# EAGLE design raspnixie (EAGLE 9.6.2)
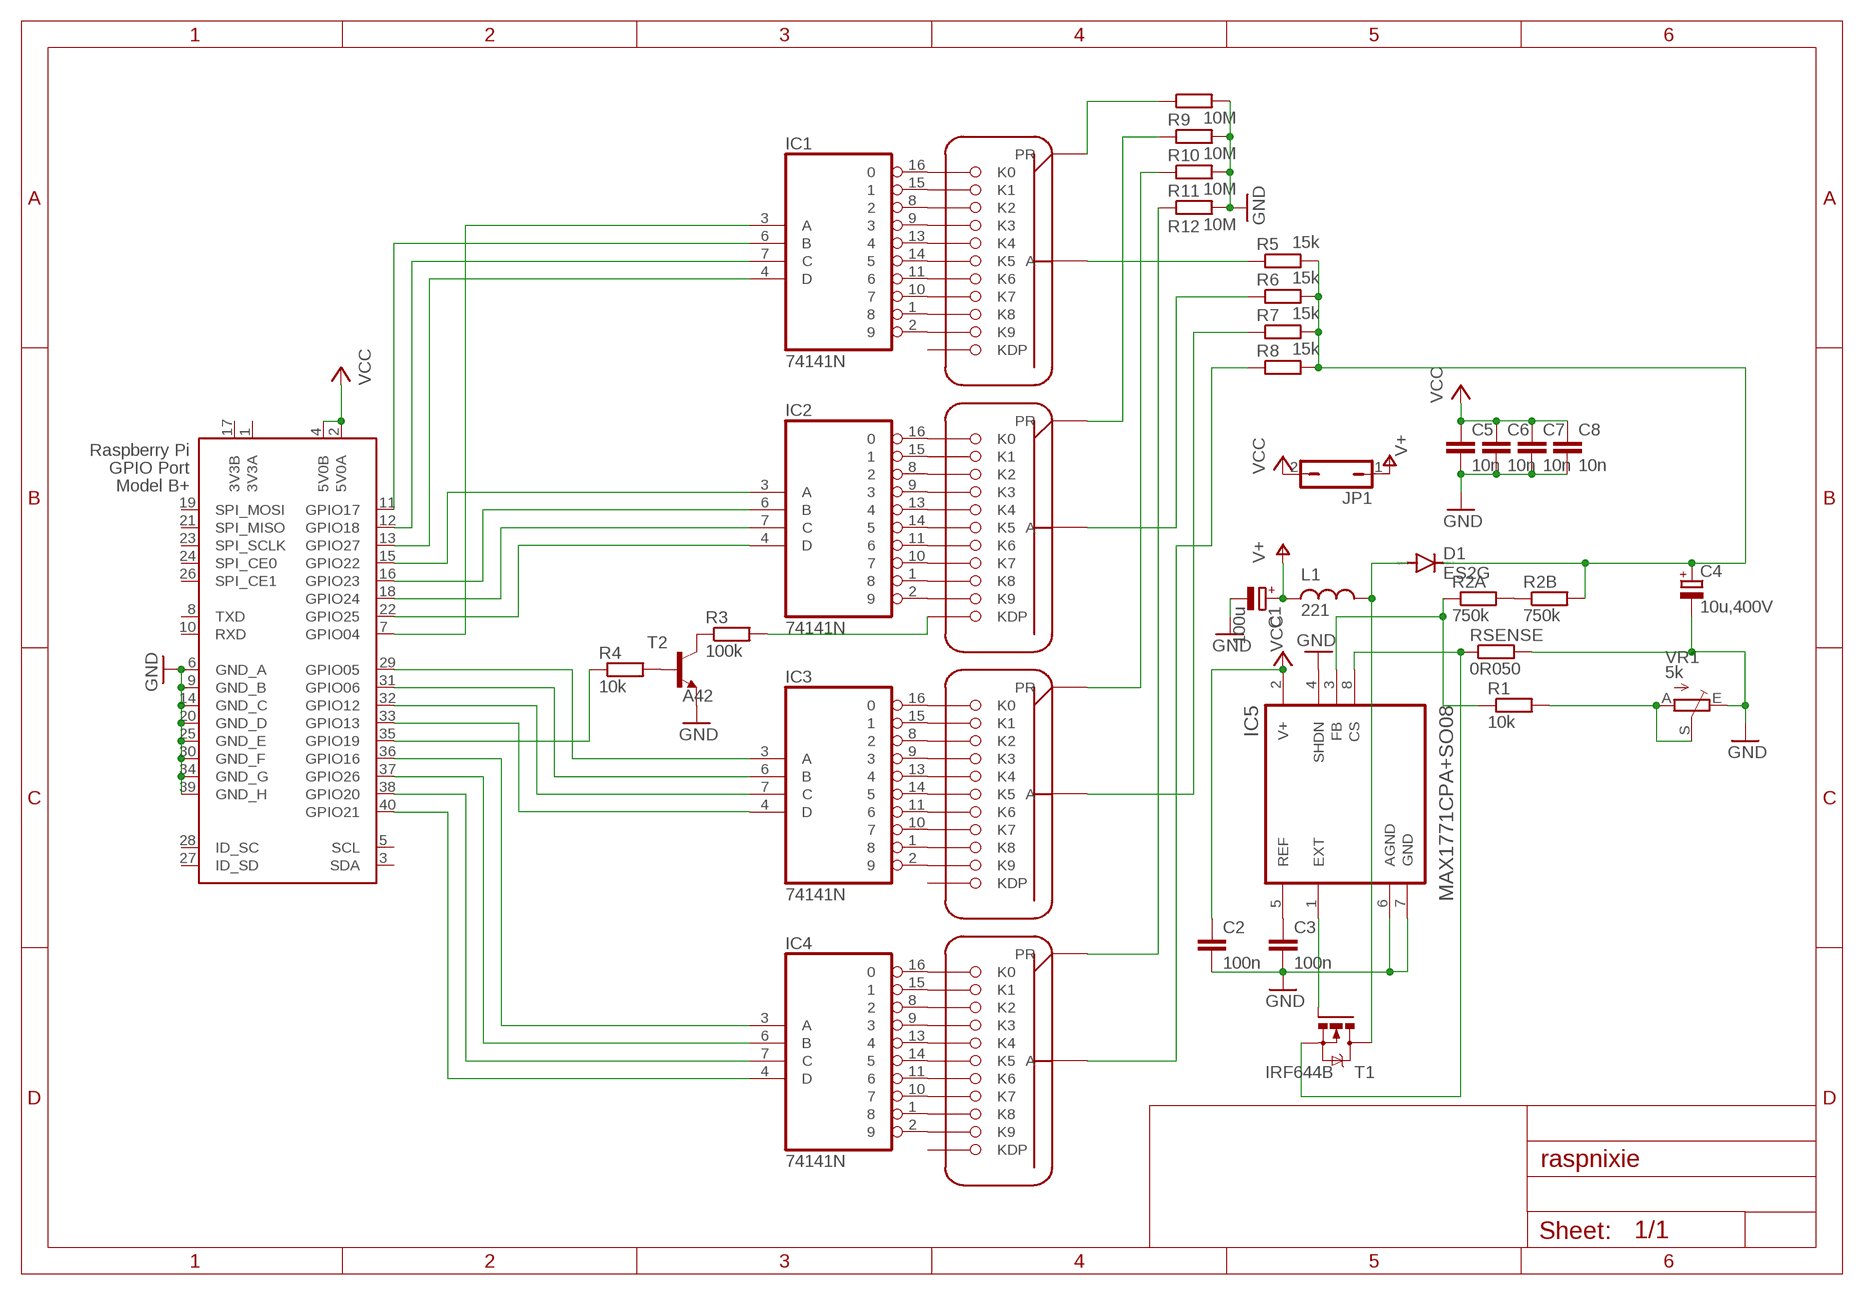
[diagram p0: schematic, sheet 1]

## Parts
C1  100u  CPOL-EUCT7343  [CT7343]
C2  100n  C-EUC1206K  [C1206K]
C3  100n  C-EUC1206K  [C1206K]
C4  10u,400V  CPOL-EUE5-10.5  [E5-10,5]
C5  10n  C-EUC1206K  [C1206K]
C6  10n  C-EUC1206K  [C1206K]
C7  10n  C-EUC1206K  [C1206K]
C8  10n  C-EUC1206K  [C1206K]
D1  ES2G  DIODE-DO214AA  [DO214AA]
IC1  74141N  [DIL16]
IC2  74141N  [DIL16]
IC3  74141N  [DIL16]
IC4  74141N  [DIL16]
IC5  MAX1771CPA+SO08  [SO08]
JP1  JP1Q  [JP1]
L1  221  WHC1770  [RESM175170X700N]
R1  10k  R-EU_R1206  [R1206]
R2A  750k  R-EU_R1206  [R1206]
R2B  750k  R-EU_R1206  [R1206]
R3  100k  R-EU_R1206  [R1206]
R4  10k  R-EU_R1206  [R1206]
R5  15k  R-EU_R1206  [R1206]
R6  15k  R-EU_R1206  [R1206]
R7  15k  R-EU_R1206  [R1206]
R8  15k  R-EU_R1206  [R1206]
R9  10M  R-EU_R1206  [R1206]
R10  10M  R-EU_R1206  [R1206]
R11  10M  R-EU_R1206  [R1206]
R12  10M  R-EU_R1206  [R1206]
RSENSE  0R050  R-EU_R2010  [R2010]
T1  IRF644B  IRF540  [TO220BV]
T2  A42  -NPN-TO92  [TO92]
U1  ZM1000  [ZM1000]
U2  ZM1000  [ZM1000]
U3  ZM1000  [ZM1000]
U4  ZM1000  [ZM1000]
VR1  5k  TRIM_EU-S64W-ROUND  [S64W-ROUND]
X1  RASPI_BOARD_B+#_E3  [RASPI_BOARD_B+_EDGES_3DRILL]

## Nets
GND: C1.- C2.2 C3.2 C4.- C5.2 C6.2 C7.2 C8.2 IC5.4(SHDN) IC5.6(AGND) IC5.7(GND) R9.2 R10.2 R11.2 R12.2 RSENSE.2 T2.1(E) VR1.E X1.6(GND_A) X1.9(GND_B) X1.14(GND_C) X1.20(GND_D) X1.25(GND_E) X1.30(GND_F) X1.34(GND_G) X1.39(GND_H)
N$1: R9.1 U1.PR
N$2: R10.1 U2.PR
N$3: R11.1 U3.PR
N$4: R12.1 U4.PR
N$5: IC1.2 U1.K9
N$6: IC1.16 U1.K0
N$7: IC1.15 U1.K8(K1)
N$8: IC1.8 U1.K2
N$9: IC1.9 U1.K3
N$10: IC1.13 U1.K4
N$11: IC1.14 U1.K5
N$12: IC1.11 U1.K6
N$13: IC1.10 U1.K7
N$14: IC1.1 U1.K1(K8)
N$15: IC2.2 U2.K9
N$16: IC2.16 U2.K0
N$17: IC2.15 U2.K8(K1)
N$18: IC2.8 U2.K2
N$19: IC2.9 U2.K3
N$20: IC2.13 U2.K4
N$21: IC2.14 U2.K5
N$22: IC2.11 U2.K6
N$23: IC2.10 U2.K7
N$24: IC2.1 U2.K1(K8)
N$25: IC3.2 U3.K9
N$26: IC3.16 U3.K0
N$27: IC3.15 U3.K8(K1)
N$28: IC3.8 U3.K2
N$29: IC3.9 U3.K3
N$30: IC3.13 U3.K4
N$31: IC3.14 U3.K5
N$32: IC3.11 U3.K6
N$33: IC3.10 U3.K7
N$34: IC3.1 U3.K1(K8)
N$35: IC4.2 U4.K9
N$36: IC4.16 U4.K0
N$37: IC4.15 U4.K8(K1)
N$38: IC4.8 U4.K2
N$39: IC4.9 U4.K3
N$40: IC4.13 U4.K4
N$41: IC4.14 U4.K5
N$42: IC4.11 U4.K6
N$43: IC4.10 U4.K7
N$44: IC4.1 U4.K1(K8)
N$45: IC1.3(A) X1.7(GPIO04)
N$46: IC1.6(B) X1.11(GPIO17)
N$47: IC1.7(C) X1.12(GPIO18)
N$48: IC1.4(D) X1.13(GPIO27)
N$49: C3.1 IC5.5(REF)
N$50: IC2.6(B) X1.16(GPIO23)
N$51: IC2.7(C) X1.18(GPIO24)
N$52: IC2.4(D) X1.22(GPIO25)
N$53: IC3.3(A) X1.29(GPIO05)
N$54: IC3.6(B) X1.31(GPIO06)
N$55: IC3.7(C) X1.32(GPIO12)
N$56: IC3.4(D) X1.33(GPIO13)
N$57: IC4.3(A) X1.36(GPIO16)
N$58: IC4.6(B) X1.37(GPIO26)
N$59: IC4.7(C) X1.38(GPIO20)
N$60: IC4.4(D) X1.40(GPIO21)
N$61 [power]: IC5.1(EXT) T1.G
N$62 [power]: D1.A L1.2 T1.D
N$63 [power]: IC5.8(CS) RSENSE.1 T1.S
N$64: IC2.3(A) X1.15(GPIO22)
N$65: R5.1 U1.A1(A) U1.A2(A)
N$66: R6.1 U2.A1(A) U2.A2(A)
N$67: R4.2 T2.2(B)
N$68: R3.1 T2.3(C)
N$69: R1.2 VR1.A VR1.S
N$70: IC5.3(FB) R1.1 R2A.1
N$71: R7.1 U3.A1(A) U3.A2(A)
N$72: R8.1 U4.A1(A) U4.A2(A)
N$73: R4.1 X1.35(GPIO19)
N$74: R3.2 U2.KDP
N$75: R2A.2 R2B.1
V+ [power]: C1.+ JP1.1 L1.1
VCC: C2.1 C5.1 C6.1 C7.1 C8.1 IC5.2(V+) JP1.2 X1.2(5V0A) X1.4(5V0B)
VH: C4.+ D1.C R2B.2 R5.2 R6.2 R7.2 R8.2
Unconnected: U1.KDP U3.KDP U4.KDP X1.3(SDA) X1.5(SCL) X1.8(TXD) X1.10(RXD) X1.19(SPI_MOSI) X1.21(SPI_MISO) X1.23(SPI_SCLK) X1.24(SPI_CE0) X1.26(SPI_CE1) X1.27(ID_SD) X1.28(ID_SC)

## Power pins joined to a net without a drawn wire
3V3A: X1.1(3V3A)
3V3B: X1.17(3V3B)
GND: IC1.12(GND) IC2.12(GND) IC3.12(GND) IC4.12(GND)
VCC: IC1.5(VCC) IC2.5(VCC) IC3.5(VCC) IC4.5(VCC)

## Library data of the parts
C1 C4 = rcl:CPOL-EU: POLARIZED CAPACITOR, European symbol; SPICEPREFIX: C
C2 C3 C5-C8 = rcl:C-EU: CAPACITOR, European symbol; SPICEPREFIX: C
D1 = diode:DIODE-: DIODE
IC1-IC4 = raspnixie:74*141: BCD to decimal DECODER/DRIVER
IC5 = raspnixie:MAX1771CPA+: None
JP1 = jumper:JP1Q: JUMPER
L1 = raspnixie:WHC1770
R1 R2A R2B R3-R12 RSENSE = rcl:R-EU_: RESISTOR, European symbol; SPICEPREFIX: R
T1 = transistor-power:IRF540: HEXFET Power MOSFET
T2 = transistor:*-NPN-: NPN Transistror BF959 corrected 2008.03.06
U1-U4 = raspnixie:ZM1000
VR1 = raspnixie:TRIM_EU-: POTENTIOMETER
X1 = raspnixie:RASPI_BOARD_B+#: Raspberry Pi GPIO connector with markings for the outer dimensions of the Raspberry Pi board model B+ with different sets of drill holes or mounting pads All pins connected; SPICEPREFIX: X

## Net classes
0 default: width 0.152 mm, drill 0.3 mm, clearance 0.152 mm
1 power: width 1.397 mm, drill 0.635 mm, clearance 0.508 mm to class 0, clearance 0.508 mm

## Board
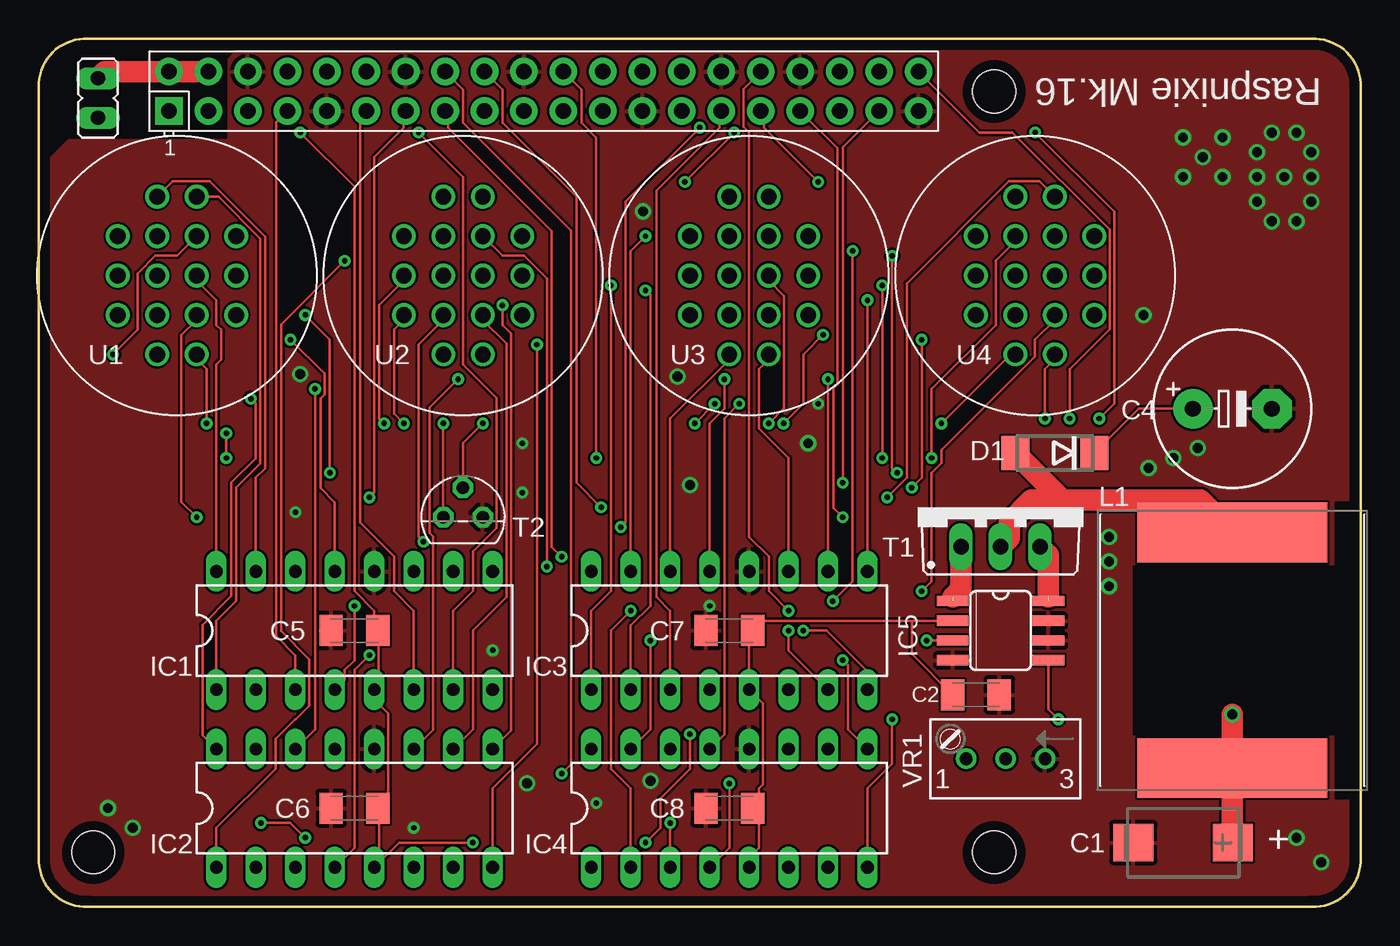
[diagram p1: board, top side]
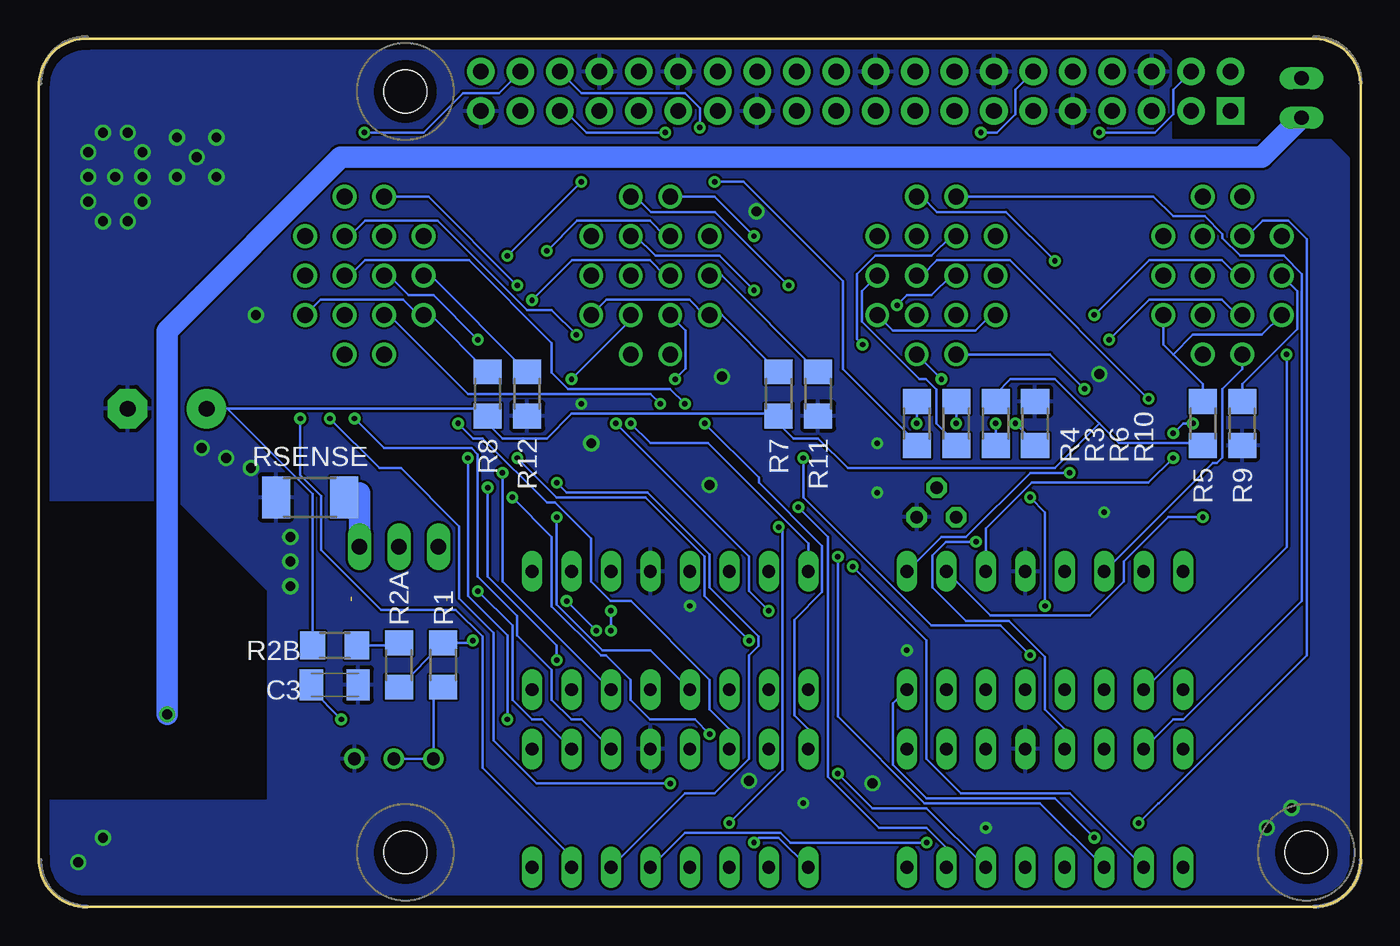
[diagram p2: board, bottom side, seen from below]

Size 85.09 x 55.88 mm. Coordinates in mm from the lower left corner, seen from the top.
Outline: 3.18,55.88 81.92,55.88 arc-90 85.09,53.02 85.09,3.18 arc-96 81.92,0 3.18,0 arc-96 0,3.18 0,53.02 arc-90 3.18,55.88
Copper layers (1*16): Top 0.035mm / dielectric 1.5mm / Bottom 0.035mm
Design rules "default *": minimum track width 6mil, minimum drill 0.35mm, track to track 6mil, track to pad 6mil, pad to pad 6mil, via to via 6mil, smd to smd 6mil, copper to edge 25mil, drill to drill 6mil, minimum pad ring 10mil, minimum via ring 8mil, stop-mask expansion 4mil, vias tented up to drill 0mil, thermal gap 10mil
tRestrict: area 70.5,7 to 84.5,26; area -0.6,48.3 to 12.7,55.2
bRestrict: area 70.5,7 to 84.5,26; area -1.3,48.3 to 12.7,55.2

### Footprints (pad centres in the part's own frame; a part is rotated, then mirrored left to right if it is on the bottom)
CT7343 = smd 2.6 x 2.4: + -3.2,0; - 3.2,0
C1206K = smd 1.5 x 2: 1 -1.5,0; 2 1.5,0
E5-10,5 = drill 1.016 pad 2.54: + -2.54,0 | drill 1.016 pad 2.54 octagon: - 2.54,0
DO214AA = smd 1.8 x 2.2: A 2.55,0; C -2.55,0
DIL16 = drill 0.813 long: 1 -8.89,-3.81; 2 -6.35,-3.81; 3 -3.81,-3.81; 4 -1.27,-3.81; 5 1.27,-3.81; 6 3.81,-3.81; 7 6.35,-3.81; 8 8.89,-3.81; 9 8.89,3.81; 10 6.35,3.81; 11 3.81,3.81; 12 1.27,3.81; 13 -1.27,3.81; 14 -3.81,3.81; 15 -6.35,3.81; 16 -8.89,3.81
SO08 = smd 0.66 x 2.032: 1 -1.905,-3.073; 2 -0.635,-3.073; 3 0.635,-3.073; 4 1.905,-3.073; 5 1.905,3.073; 6 0.635,3.073; 7 -0.635,3.073; 8 -1.905,3.073
JP1 = drill 0.914 long: 1 0,-1.27; 2 0,1.27
RESM175170X700N = smd 3.838 x 12.21: 1 -7.584,0; 2 7.584,0
R1206 = smd 1.6 x 1.803: 1 -1.422,0; 2 1.422,0
R2010 = smd 1.8 x 2.7: 1 -2.2,0; 2 2.2,0
TO220BV = drill 1.016 long: D 0,-2.54; G -2.54,-2.54; S 2.54,-2.54
TO92 = drill 0.813 octagon: 1 1.27,0; 2 0,1.905; 3 -1.27,0
ZM1000 = drill 1.016: A1 -3.81,-2.54; A2 3.81,-2.54; IC1 -3.81,2.54; IC2 3.81,2.54; K0 1.27,0; K1 1.27,5.08; K2 -1.27,2.54; K3 -1.27,0; K4 -1.27,-2.54; K5 -1.27,-5.08; K6 1.27,-5.08; K7 1.27,-2.54; K8 -1.27,5.08; K9 1.27,2.54; KDP 3.81,0; PR -3.81,0
S64W-ROUND = drill 0.813: A 2.54,1.27; E -2.54,1.27; S 0,1.27
RASPI_BOARD_B+_EDGES_3DRILL = drill 1 pad 1.778 square: 1 8.37,51.23 | drill 1 pad 1.778: 2 8.37,53.77; 3 10.91,51.23; 4 10.91,53.77; 5 13.45,51.23; 6 13.45,53.77; 7 15.99,51.23; 8 15.99,53.77; 9 18.53,51.23; 10 18.53,53.77; 11 21.07,51.23; 12 21.07,53.77; 13 23.61,51.23; 14 23.61,53.77; 15 26.15,51.23; 16 26.15,53.77; 17 28.69,51.23; 18 28.69,53.77; 19 31.23,51.23; 20 31.23,53.77; 21 33.77,51.23; 22 33.77,53.77; 23 36.31,51.23; 24 36.31,53.77; 25 38.85,51.23; 26 38.85,53.77; 27 41.39,51.23; 28 41.39,53.77; 29 43.93,51.23; 30 43.93,53.77; 31 46.47,51.23; 32 46.47,53.77; 33 49.01,51.23; 34 49.01,53.77; 35 51.55,51.23; 36 51.55,53.77; 37 54.09,51.23; 38 54.09,53.77; 39 56.63,51.23; 40 56.63,53.77 | hole 2.75: 3.5,3.5; 61.5,3.5; 61.5,52.5

### Placement (x,y rotation side)
C1  73.66,4.13 180 top
C2  60.33,13.65 0 top
C3  66.04,14.29 0 bottom
C4  76.84,32.07 0 top
C5  20.32,17.78 180 top
C6  20.32,6.35 180 top
C7  44.45,17.78 180 top
C8  44.45,6.35 180 top
D1  65.41,29.21 180 top
IC1  20.32,17.78 0 top
IC2  20.32,6.35 0 top
IC3  44.45,17.78 0 top
IC4  44.45,6.35 0 top
IC5  61.91,17.78 270 top
JP1  3.81,52.07 0 top
L1  76.84,16.51 90 top
R1  59.06,15.56 270 bottom
R2A  61.91,15.56 90 bottom
R2B  66.04,16.83 180 bottom
R3  26.04,31.12 270 bottom
R4  28.58,31.12 90 bottom
R5  10.16,31.12 270 bottom
R6  23.5,31.12 90 bottom
R7  37.47,33.02 270 bottom
R8  56.2,33.02 270 bottom
R9  7.62,31.12 270 bottom
R10  20.96,31.12 90 bottom
R11  34.93,33.02 270 bottom
R12  53.66,33.02 270 bottom
RSENSE  67.63,26.35 180 bottom
T1  61.91,25.72 0 top
T2  27.31,25.08 0 top
U1  8.89,40.64 0 top
U2  27.31,40.64 0 top
U3  45.72,40.64 0 top
U4  64.14,40.64 0 top
VR1  62.23,10.8 180 top
X1  0,0 0 top

### Tracks (layer width: path | path; a pad name or v marks a point on that pad's centre or on a via)
GND  (via drill 0.35, 0.64)
  other vias: 50.17,32.39 43.18,19.37 31.12,26.67 31.12,29.85 35.88,6.67 24.13,5.08 29.21,16.51 73.66,46.99 73.66,49.53 74.93,48.26 76.2,46.99 76.2,49.53 78.42,48.58 78.42,46.99 78.42,45.4 79.38,49.85 80.96,49.85 81.92,48.58 81.92,46.99 80.17,46.99 79.38,44.13 80.96,44.13 81.92,45.4 41.12,34.13 49.53,29.85 71.44,28.26 41.91,27.15 39.37,8.1 31.43,7.94 16.83,34.29 38.9,44.77 73.03,28.89 74.61,29.53 68.9,23.81 68.9,22.23 68.9,20.64 82.55,2.86 71.12,38.1 80.96,4.45 16.51,25.4 6.03,5.08 4.45,6.35
  pour Top: -2.54,58.42 -2.54,-11.43 88.9,-11.43 88.9,58.42
  pour Bottom: -2.54,58.42 -2.54,-15.24 88.9,-15.24 88.9,58.42
N$1
  Bottom 0.152: R9.1 7.62,33.66 4.09,37.19 4.09,39.65 U1.PR
N$2  (via drill 0.35)
  Top 0.152: v22.23,31.12 21.91,31.43 21.91,38.74 23.5,40.32 U2.PR
  Bottom 0.152: v22.23,31.12 20.96,29.85 R10.1
N$3
  Bottom 0.152: U3.PR 41.12,40.64 R11.1
N$4
  Bottom 0.152: U4.PR 59.86,40.64 R12.1
N$5  (via drill 0.35)
  Top 0.152: v4.76,35.56 6.35,37.15 6.35,40.77 7.49,41.91 8.89,41.91 U1.K9
  Bottom 0.152: IC1.2 4.76,23.18 v4.76,35.56
N$6
  Top 0.152: IC1.16 11.43,34.93 11.75,35.24 11.75,37.15 11.43,37.47 11.43,39.05 10.16,40.32 U1.K0
N$7
  Top 0.152: IC1.15 13.97,27.62 14.57,28.22 14.57,43.15 11,46.71 8.61,46.71 U1.K8
N$8  (via drill 0.35)
  Top 0.152: v17.15,4.45 16.19,5.4 v14.29,5.4
  Bottom 0.152: U1.K2 7.3,43.18 6.31,44.17 4.67,44.17 3.48,42.98 3.48,16.19 13.01,6.67 13.02,6.67 v14.29,5.4 | IC1.8 30.1,13.08 30.1,9.13 27.95,6.99 19.69,6.99 v17.15,4.45
N$9  (via drill 0.35)
  Top 0.152: v18.73,27.94 18.73,36.51 v17.15,38.1
  Bottom 0.152: v18.73,27.94 21.27,27.94 25.4,23.81 26.99,23.81 IC1.9 | U1.K3 7.94,40.64 8.93,41.63 13.62,41.63 v17.15,38.1
N$10  (via drill 0.35)
  Top 0.152: IC1.13 19.05,26.04 18.13,26.96 18.13,32.73 18.39,32.99 18.39,34.32 v16.19,36.51
  Bottom 0.152: U1.K4 7.94,38.1 8.93,39.09 13.62,39.09 v16.19,36.51
N$11
  Bottom 0.152: U1.K5 7.62,34.61 8.89,33.34 8.89,28.94 9.25,28.58 9.53,28.58 IC1.14
N$12  (via drill 0.35)
  Top 0.152: v12.07,30.48 v12.07,28.89 | v10.8,31.12 10.8,34.61 10.16,35.24 U1.K6
  Bottom 0.152: v12.07,28.89 13.65,27.31 21.18,27.31 24.13,24.35 IC1.11 | v12.07,30.48 11.43,31.12 v10.8,31.12
N$13  (via drill 0.35)
  Top 0.152: U1.K7 10.16,37.78 9.17,36.79 9.17,26.07 v10.16,25.08
  Bottom 0.152: v10.16,25.08 12.4,25.08 15.24,22.24 15.24,20.94 17.42,18.76 23.84,18.76 IC1.10
N$14
  Top 0.152: IC1.1 11.43,18.42 12.7,19.69 12.7,26.99 14.26,28.55 14.26,43.02 11.56,45.72 U1.K1
N$15  (via drill 0.35)
  Top 0.152: U2.K9 29.85,41.91 31.25,41.91 32.7,40.45 v32.7,21.91
  Bottom 0.152: IC2.2 18.73,7.3 25.73,7.3 27.94,9.51 27.94,17.15 v32.7,21.91
N$16  (via drill 0.35)
  Top 0.152: v13.65,32.7 13.94,32.41 13.94,28.87 12.38,27.31 12.38,20 10.54,18.16 10.54,11.05 IC2.16
  Bottom 0.152: U2.K0 28.26,40.64 27.27,41.63 22.58,41.63 v13.65,32.7
N$17
  Bottom 0.152: IC2.15 12.07,12.07 11.42,12.07 3.79,19.7 3.79,40.75 4.95,41.91 7.75,41.91 8.89,43.05 8.89,43.31 10.03,44.45 12.07,44.45 13.34,45.72 U2.K8
N$18  (via drill 0.35)
  Top 0.152: IC2.8 29.21,7.62 32.07,10.48 v32.07,36.2
  Bottom 0.152: U2.K2 26.35,43.18 27.62,41.91 31.25,41.91 32.41,40.75 32.41,36.54 v32.07,36.2
N$19  (via drill 0.35)
  Top 0.152: v29.85,38.74 29.85,37.47 30.41,36.91 30.41,11.36 IC2.9
  Bottom 0.152: v29.85,38.74 29.21,39.37 27.62,39.37 26.35,40.64 U2.K3
N$20  (via drill 0.35)
  Top 0.152: v24.77,23.5 24.45,23.81 24.45,36.2 26.04,37.78 U2.K4
  Bottom 0.152: IC2.13 19.05,11.43 20.32,12.7 20.32,16.1 22.64,18.42 25.41,18.42 27.56,20.56 27.56,22.62 26.68,23.5 v24.77,23.5
N$21  (via drill 0.35)
  Top 0.152: IC2.14 17.78,11.43 v17.78,33.34
  Bottom 0.152: v17.78,33.34 20,35.56 U2.K5
N$22  (via drill 0.35)
  Top 0.152: v26.99,33.97 25.15,32.13 25.15,24.07 25.37,23.84 25.37,11.4 IC2.11
  Bottom 0.152: U2.K6 v26.99,33.97
N$23
  Top 0.152: U2.K7 28.58,37.78 30.1,36.26 30.1,19.94 27.94,17.78 27.94,11.43 IC2.10
N$24  (via drill 0.35)
  Top 0.152: IC2.1 11.43,5.08 15.24,8.89 15.24,10.81 16.5,12.07 16.52,12.07 17.4,12.94 17.4,15.94 15.59,17.75 15.59,37.49 v19.69,41.59
  Bottom 0.152: U2.K1 28.26,45.72 27.27,44.73 22.82,44.73 v19.69,41.59
N$25  (via drill 0.35)
  Top 0.152: IC3.2 38.1,18.1 39.37,19.37 39.37,39.37 v39.05,39.69
  Bottom 0.152: v39.05,39.69 41.28,41.91 45.4,41.91 46.67,43.18 U3.K9
N$26  (via drill 0.35)
  Top 0.152: U3.K0 46.99,40.32 47.98,39.33 47.98,32.11 v46.99,31.12
  Bottom 0.152: v46.99,31.12 45.72,29.85 42.01,29.85 35.56,23.4 IC3.16
N$27  (via drill 0.35)
  Top 0.152: IC3.15 38.1,42.23 v39.05,43.18
  Bottom 0.152: v39.05,43.18 41.59,45.72 U3.K8
N$28  (via drill 0.35)
  Top 0.152: v49.21,17.78 50.71,17.78 53.34,15.15 IC3.8 | v52.39,42.23 52.39,20.96 v51.12,19.69
  Bottom 0.152: v51.12,19.69 v49.21,17.78 | U3.K2 44.77,43.18 45.76,44.17 50.45,44.17 v52.39,42.23
N$29  (via drill 0.35)
  Top 0.152: v53.34,39.05 IC3.9
  Bottom 0.152: U3.K3 44.77,40.64 45.76,41.63 50.76,41.63 v53.34,39.05
N$30  (via drill 0.35)
  Top 0.152: IC3.13 43.18,31.12 44.13,32.07 v44.13,33.97
  Bottom 0.152: U3.K4 43.46,37.11 43.46,34.65 v44.13,33.97
N$31
  Top 0.152: IC3.14 40.64,31.43 44.45,35.24 U3.K5
N$32
  Top 0.152: IC3.11 48.26,28.89 46.36,30.8 46.36,34.61 46.99,35.24 U3.K6
N$33  (via drill 0.35)
  Top 0.152: v50.8,33.97 IC3.10
  Bottom 0.152: v50.8,33.97 46.99,37.78 U3.K7
N$34  (via drill 0.35)
  Top 0.152: IC3.1 35.56,19.05 36.83,20.32 v36.83,40.01
  Bottom 0.152: U3.K1 46.67,45.72 45.68,44.73 41.56,44.73 v36.83,40.01
N$35  (via drill 0.35)
  Top 0.152: IC4.2 38.1,7.62 36.83,8.89 36.83,17.78 v38.1,19.05 | v47.94,31.12 49.21,32.39 49.21,35.56 v50.48,36.83
  Bottom 0.152: v38.1,19.05 39.37,20.32 39.37,22.54 v47.94,31.12 | v50.48,36.83 52.07,38.42 53.66,38.42 59.41,44.17 64.1,44.17 65.09,43.18 U4.K9
N$36  (via drill 0.35)
  Top 0.152: v43.5,32.39 v42.23,31.12
  Bottom 0.152: v43.5,32.39 44.45,33.34 51.02,33.34 52.07,34.39 52.07,36.31 57.39,41.63 64.1,41.63 65.09,40.64 U4.K0 | IC4.16 35.56,11.43 36.45,12.32 36.45,18.48 34.67,20.26 34.67,23.24 38.74,27.31 38.74,27.62 v42.23,31.12
N$37  (via drill 0.35)
  Top 0.152: v54.29,40.01 v54.29,28.89 | v39.37,17.15 39.37,11.43 IC4.15
  Bottom 0.152: v54.29,28.89 51.75,26.35 46.03,26.35 42.23,22.56 42.23,20 v39.37,17.15 | v54.29,40.01 60.01,45.72 U4.K8
N$38  (via drill 0.35)
  Top 0.152: IC4.8 53.34,7.62 54.93,9.21 v54.93,12.07 | v57.47,28.89 57.47,33.34 61.6,37.47 61.6,41.59 62.87,42.86 U4.K2
  Bottom 0.152: v57.47,28.89 57.47,20 54.93,17.46 v54.93,12.07
N$39  (via drill 0.35)
  Top 0.152: v51.75,15.88 52.07,15.56 52.07,11.43 IC4.9 | v56.2,26.99 56.83,27.62 v56.83,36.51
  Bottom 0.152: v51.75,15.88 51.75,16.83 56.2,21.27 v56.2,26.99 | v56.83,36.51 59.69,39.37 61.28,39.37 62.55,40.64 U4.K3
N$40  (via drill 0.35)
  Top 0.152: v45.09,32.39 44.13,31.43 44.13,11.11 IC4.13
  Bottom 0.152: v45.09,32.39 45.72,33.02 57.47,33.02 62.55,38.1 U4.K4
N$41  (via drill 0.35)
  Top 0.152: U4.K5 62.55,35.56 v58.1,31.12
  Bottom 0.152: v58.1,31.12 57.15,30.16 56.52,30.16 52.39,26.04 51.85,26.04 49.53,23.72 49.53,20.94 48.27,19.69 46.98,19.69 41.91,14.62 41.91,12.7 40.64,11.43 IC4.14
N$42  (via drill 0.35)
  Top 0.152: v64.77,31.43 64.77,34.61 65.41,35.24 U4.K6
  Bottom 0.152: IC4.11 50.17,12.07 50.81,12.07 52.07,13.32 52.07,15.24 54.29,17.46 54.29,18.73 56.83,21.27 56.83,29.12 57.25,29.53 62.87,29.53 v64.77,31.43
N$43  (via drill 0.35)
  Top 0.152: v56.83,20.32 57.47,20.96 57.47,27.94 58.1,28.58 58.1,29.4 64.14,35.43 64.14,36.51 65.41,37.78 U4.K7
  Bottom 0.152: IC4.10 52.71,12.07 53.35,12.07 54.61,13.32 54.61,18.1 v56.83,20.32
N$44  (via drill 0.35)
  Top 0.152: v39.05,4.13 40.01,5.08 40.01,6.99 41.91,8.89 v41.91,11.11 | v54.61,26.35 55.88,27.62 55.88,40.14 62.46,46.71 64.42,46.71 U4.K1
  Bottom 0.152: IC4.1 37.47,4.45 38.74,4.45 v39.05,4.13 | v41.91,11.11 42.86,12.07 45.73,12.07 46.99,13.32 46.99,14.62 48.57,16.19 48.92,16.19 52.07,19.35 52.07,23.81 v54.61,26.35
N$45
  Top 0.152: IC1.3 16.51,16.19 15.28,17.42 15.28,50.52 X1.7
N$46
  Top 0.152: IC1.6 24.13,19.05 22.86,20.32 22.86,22.54 20.67,24.74 20.67,50.83 X1.11
N$47  (via drill 0.35)
  Top 0.152: IC1.7 26.67,19.05 27.94,20.32 27.94,22.86 29.47,24.39 29.47,32.77 27.31,34.93 27.31,46.99 v24.45,49.85
  Bottom 0.152: X1.12 22.23,52.62 22.23,51.04 23.41,49.85 v24.45,49.85
N$48  (via drill 0.35)
  Top 0.152: IC1.4 19.69,14.61 19.69,15.24 20.32,15.88 v20.32,19.37 | v21.27,26.35 21.59,26.67 21.59,48.26 23.5,50.17 23.5,51.12 X1.13
  Bottom 0.152: v21.27,26.35 20.32,25.4 v20.32,19.37
N$49  (via drill 0.35)
  Top 0.152: IC5.5 64.99,12.7 v65.63,12.07
  Bottom 0.152: v65.63,12.07 67.54,13.98 C3.1
N$50  (via drill 0.35)
  Top 0.152: v33.66,8.57 34.26,9.18 34.26,43.53 27.31,50.48 27.31,52.62 X1.16
  Bottom 0.152: v33.66,8.57 31.43,6.35 27.94,6.35 IC2.6
N$51  (via drill 0.35)
  Top 0.152: v36.2,25.72 34.61,27.31 34.61,45.72 29.85,50.48 29.85,52.62 X1.18
  Bottom 0.152: v36.2,25.72 34.29,23.81 34.29,8.35 31.02,5.08 27.94,5.08 26.67,3.81 IC2.7
N$52  (via drill 0.35)
  Top 0.152: v21.27,16.19 20.32,15.24 20.32,3.81 IC2.4 | X1.22 34.93,52.62 34.93,50.48 35.88,49.53 v35.88,28.89
  Bottom 0.152: v21.27,16.19 23.18,18.1 27.64,18.1 35.88,26.34 v35.88,28.89
N$53
  Top 0.152: IC3.3 40.64,19.05 39.75,19.94 39.75,46.1 43.82,50.17 43.82,51.12 X1.29
N$54  (via drill 0.35)
  Top 0.152: v55.25,27.94 54.93,28.26 v54.93,41.91 | v50.17,46.67 46.67,50.17 46.67,51.03 X1.31
  Bottom 0.152: v55.25,27.94 55.25,20.96 IC3.6 | v50.17,46.67 v54.93,41.91
N$55  (via drill 0.35)
  Top 0.152: X1.32 45.35,52.65 45.35,50.22 45.72,49.85 45.72,23.81 46.99,22.54 46.99,20.32 v48.26,19.05 | v48.26,17.78 48.26,16.51 IC3.7
  Bottom 0.152: v48.26,19.05 v48.26,17.78
N$56  (via drill 0.35)
  Top 0.152: v51.75,25.08 51.15,25.69 51.15,33.37 51.41,33.63 51.41,48.83 X1.33
  Bottom 0.152: IC3.4 45.72,16.51 48.8,16.51 51.75,19.46 v51.75,25.08
N$57  (via drill 0.35)
  Top 0.152: v40.64,5.4 IC4.3 | v37.47,24.45 37.78,24.77 37.78,45.4 v42.55,50.17
  Bottom 0.152: v42.55,50.17 42.55,51.43 43.51,52.39 50.17,52.39 X1.36 | v37.47,24.45 37.21,24.19 37.21,8.83 v40.64,5.4
N$58  (via drill 0.35)
  Top 0.152: X1.37 51.75,48.89 v51.75,27.31
  Bottom 0.152: IC4.6 43.5,7.3 41.58,7.3 39.37,9.51 39.37,16.19 38.76,16.8 38.76,17.4 41.91,20.54 41.91,22.67 45.91,26.67 51.12,26.67 v51.75,27.31
N$59  (via drill 0.35)
  Top 0.152: v68.26,31.43 69.24,32.41 69.24,44.74 v64.14,49.85
  Bottom 0.152: v64.14,49.85 60.33,49.85 57.79,52.39 55.47,52.39 X1.38 | IC4.7 50.8,3.2 56.54,8.94 56.54,17.4 58.27,19.13 63.07,19.13 66.91,22.97 66.91,26.44 68.26,27.79 v68.26,31.43
N$60  (via drill 0.35)
  Top 0.152: v66.36,31.43 66.36,34.61 68.94,37.19 68.94,43.59 62.68,49.85 60.55,49.85 X1.40 | v44.45,7.94 44.45,3.81 IC4.4
  Bottom 0.152: v66.36,31.43 63.17,28.25 61.78,28.25 58.03,24.5 58.03,19.85 55.82,17.64 55.82,10.72 53.04,7.94 v44.45,7.94
N$61  (1 unrouted)
  Top 1.397: T1.G 59.37,20.49 58.84,19.95
N$62
  Top 1.397: T1.D 62.49,23.75 62.49,24.76 63.91,26.18 65.89,26.18 | L1.2 74.76,26.18 66.04,26.18 65.89,26.18 | D1.A 65.89,26.18
N$63  (1 unrouted)
  Top 1.397: T1.S 64.99,22.65 64.99,19.95
  Bottom 1.397: RSENSE.1 64.45,26.65 T1.S
N$64  (via drill 0.35)
  Top 0.152: v33.66,22.54 33.02,23.18 33.02,43.5 26.35,50.17 26.35,51.03 X1.15
  Bottom 0.152: IC2.3 20.64,6.67 28.07,6.67 33.66,12.26 v33.66,22.54
N$65
  Bottom 0.152: 12.07,35.56 12.7,36.2 U1.A2 | U1.A1 6.35,36.83 10.8,36.83 12.07,35.56 | R5.1 10.16,33.66 12.07,35.56
N$66  (via drill 0.35)
  Top 0.152: v23.5,31.12 22.86,31.75 22.86,37.15 23.5,37.78 U2.A1
  Bottom 0.152: v23.5,31.12 R6.1 | U2.A1 23.81,38.1 24.8,37.11 30.13,37.11 U2.A2
N$67  (via drill 0.35)
  Top 0.152: v28.58,31.12 27.31,29.85 T2.2
  Bottom 0.152: v28.58,31.12 R4.2
N$68  (via drill 0.35)
  Top 0.152: T2.3 v26.04,31.12
  Bottom 0.152: v26.04,31.12 R3.1
N$69
  Bottom 0.152: VR1.S VR1.A 59.69,13.5 R1.2
N$70  (via drill 0.35)
  Top 0.152: IC5.3 v57.15,17.15
  Bottom 0.152: v57.15,17.15 57.32,16.98 R1.1 61.9,14.14 R2A.1
N$71
  Bottom 0.152: R7.1 41.12,38.1 U3.A1 42.23,38.1 43.22,39.09 48.54,39.09 U3.A2
N$72
  Bottom 0.152: R8.1 59.86,38.1 U4.A1 60.64,38.1 61.63,39.09 66.96,39.09 U4.A2
N$73  (via drill 0.35)
  Top 0.152: v44.77,49.85 v41.59,46.67
  Bottom 0.152: v44.77,49.85 49.85,49.85 51.12,51.12 51.44,51.12 X1.35 | R4.1 28.58,29.85 33.34,34.61 33.34,40.27 39.74,46.67 v41.59,46.67
N$74
  Bottom 0.152: R3.2 26.04,29.85 27.31,31.12 27.31,33.29 27.99,33.97 28.39,33.97 32.11,37.69 32.11,39.65 U2.KDP
N$75
  Bottom 0.152: R2A.2 62.07,16.83 R2B.1
V+  (via drill 0.64)
  Top 1.397: C1.+ 76.84,4.15 L1.1 v76.84,12.38
  Bottom 1.397: JP1.1 6.35,48.26 65.65,48.26 76.84,37.08 v76.84,12.38
VCC  (via drill 0.35)
  Top 0.152: IC5.2 56.2,18.42 | 56.2,18.42 46.59,18.42 C7.1 45.72,17.78 IC3.5 46.61,13.08 46.61,7.88 46.36,7.62 46.36,6.03 | 46.36,6.03 46.04,6.35 C8.1 46.36,6.03 | 46.36,6.03 46.36,3.81 45.72,3.18 IC4.5 | 21.91,6.35 C6.1 | v16.83,49.85 20.32,46.36 20.32,20.32 21.59,19.05 21.59,17.78 C5.1 21.88,17.72 21.88,14.9 21.59,14.61 IC1.5 21.59,13.34 22.48,12.45 22.48,6.92 21.91,6.35 | 21.91,6.35 21.91,3.49 21.59,3.18 IC2.5 23.18,4.13 v27.94,4.13 | C2.1 56.2,16.28 56.2,18.42
  Top 1.397: JP1.2 4.24,53.77 X1.2 X1.4
  Bottom 0.152: v16.83,49.85 13.25,49.85 12.07,51.04 12.07,52.62 X1.4 | v27.94,4.13 36.72,4.13 37.34,4.75 43.51,4.75 IC4.5
VH
  Top 0.152: C4.+ 70.81,32.07 D1.C
  Bottom 0.152: 57.15,32.07 C4.+ 72.97,32.07 67.46,26.56 R2B.2 | 57.15,32.07 56.67,32.07 R8.2 | 16.83,31.12 19.69,33.97 22.54,33.97 23.5,33.02 R6.2 | 16.83,31.12 15.56,29.85 10.16,29.85 R5.2 | 38.1,31.75 50.8,31.75 52.39,30.16 55.25,30.16 57.15,32.07 | 38.1,31.75 37.47,31.75 R7.2 38.1,31.75 | 16.83,31.12 19.69,28.26 33.02,28.26 34.93,30.16 36.51,30.16 38.1,31.75

### Text on the board
tNames: Raspnixie Mk.16 | +